# Altium schematic sheet 0067_SMART_C_COVER.SchDoc
size 848 x 558 mm
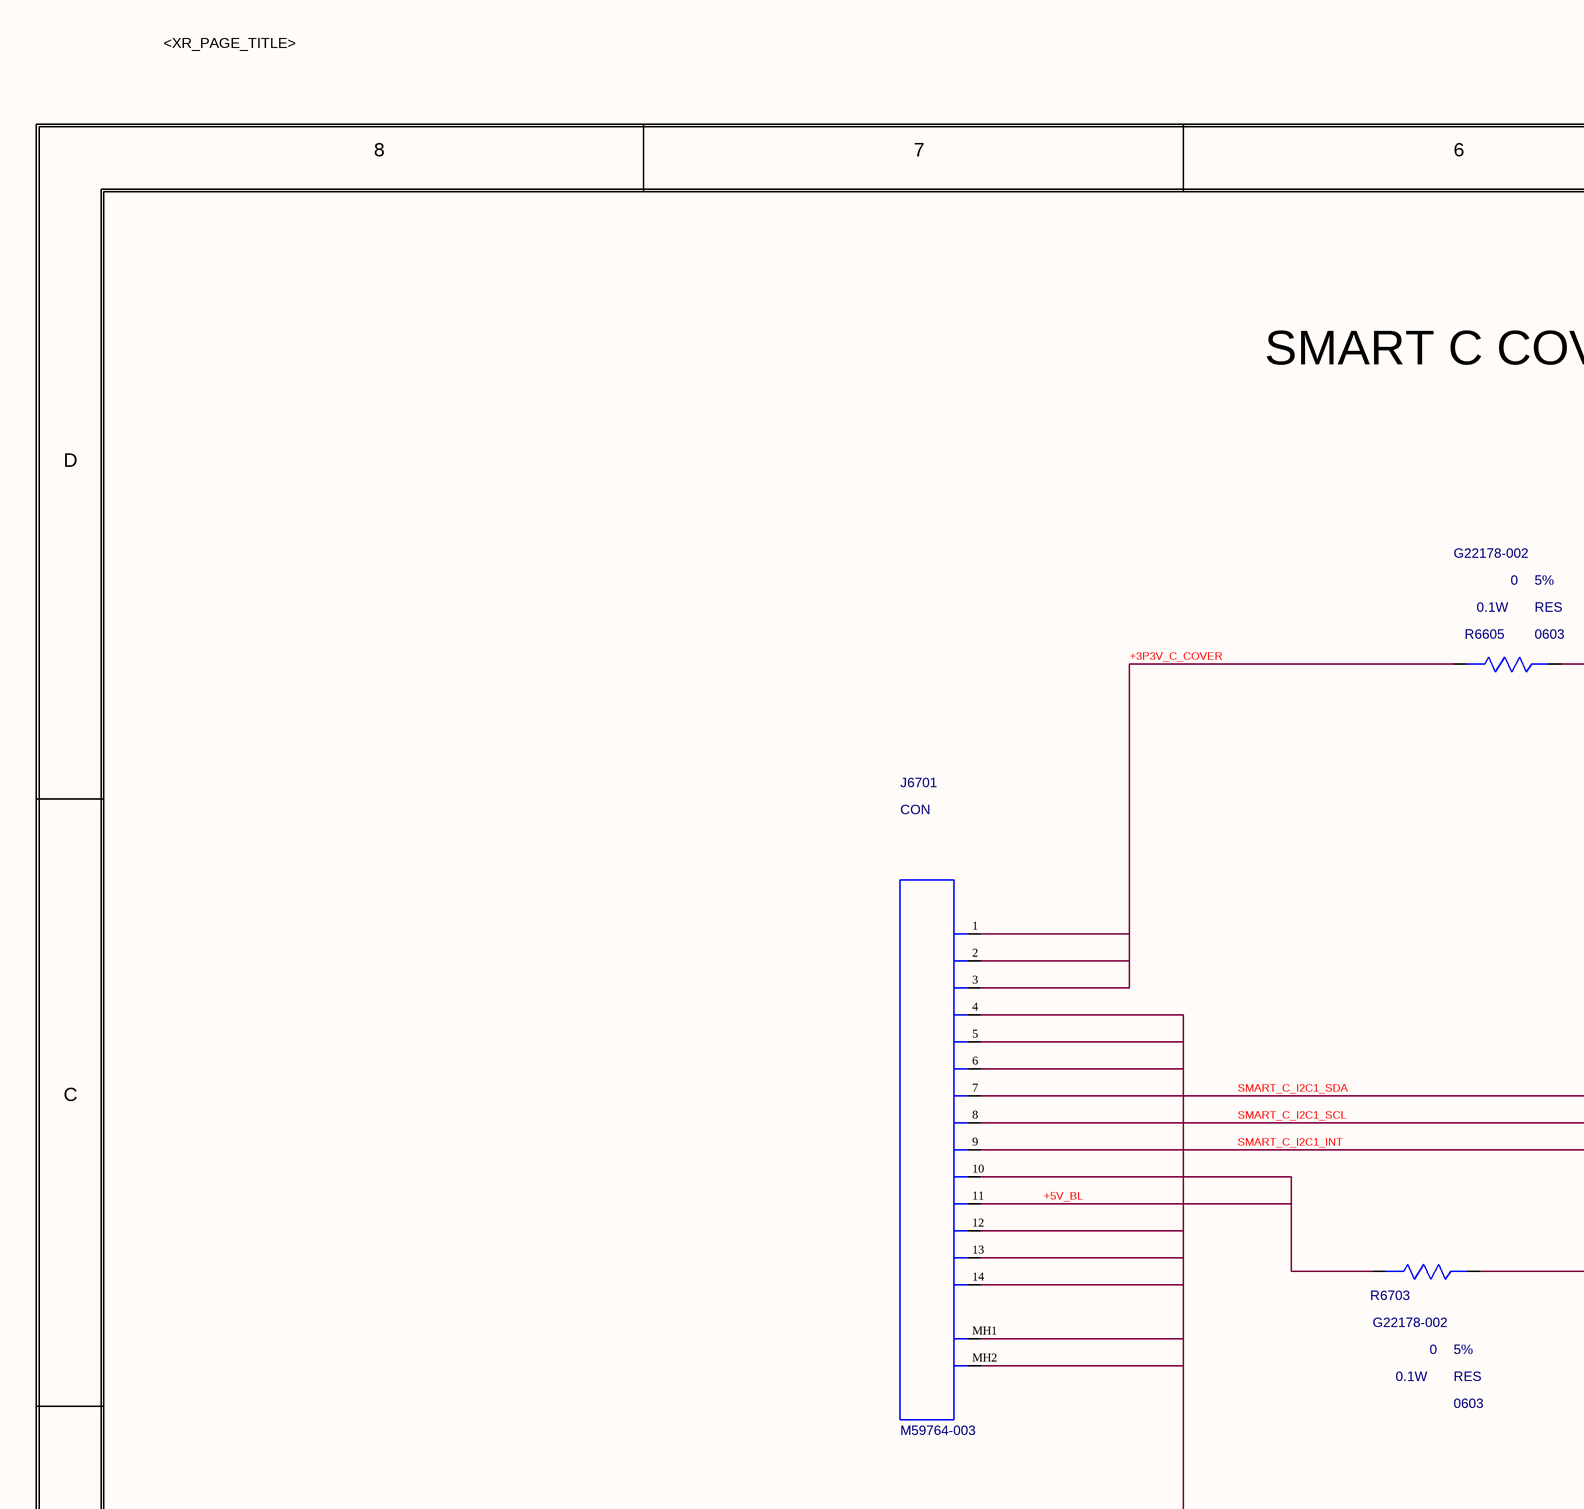
[diagram p0: 0067_SMART_C_COVER.SchDoc, top left]
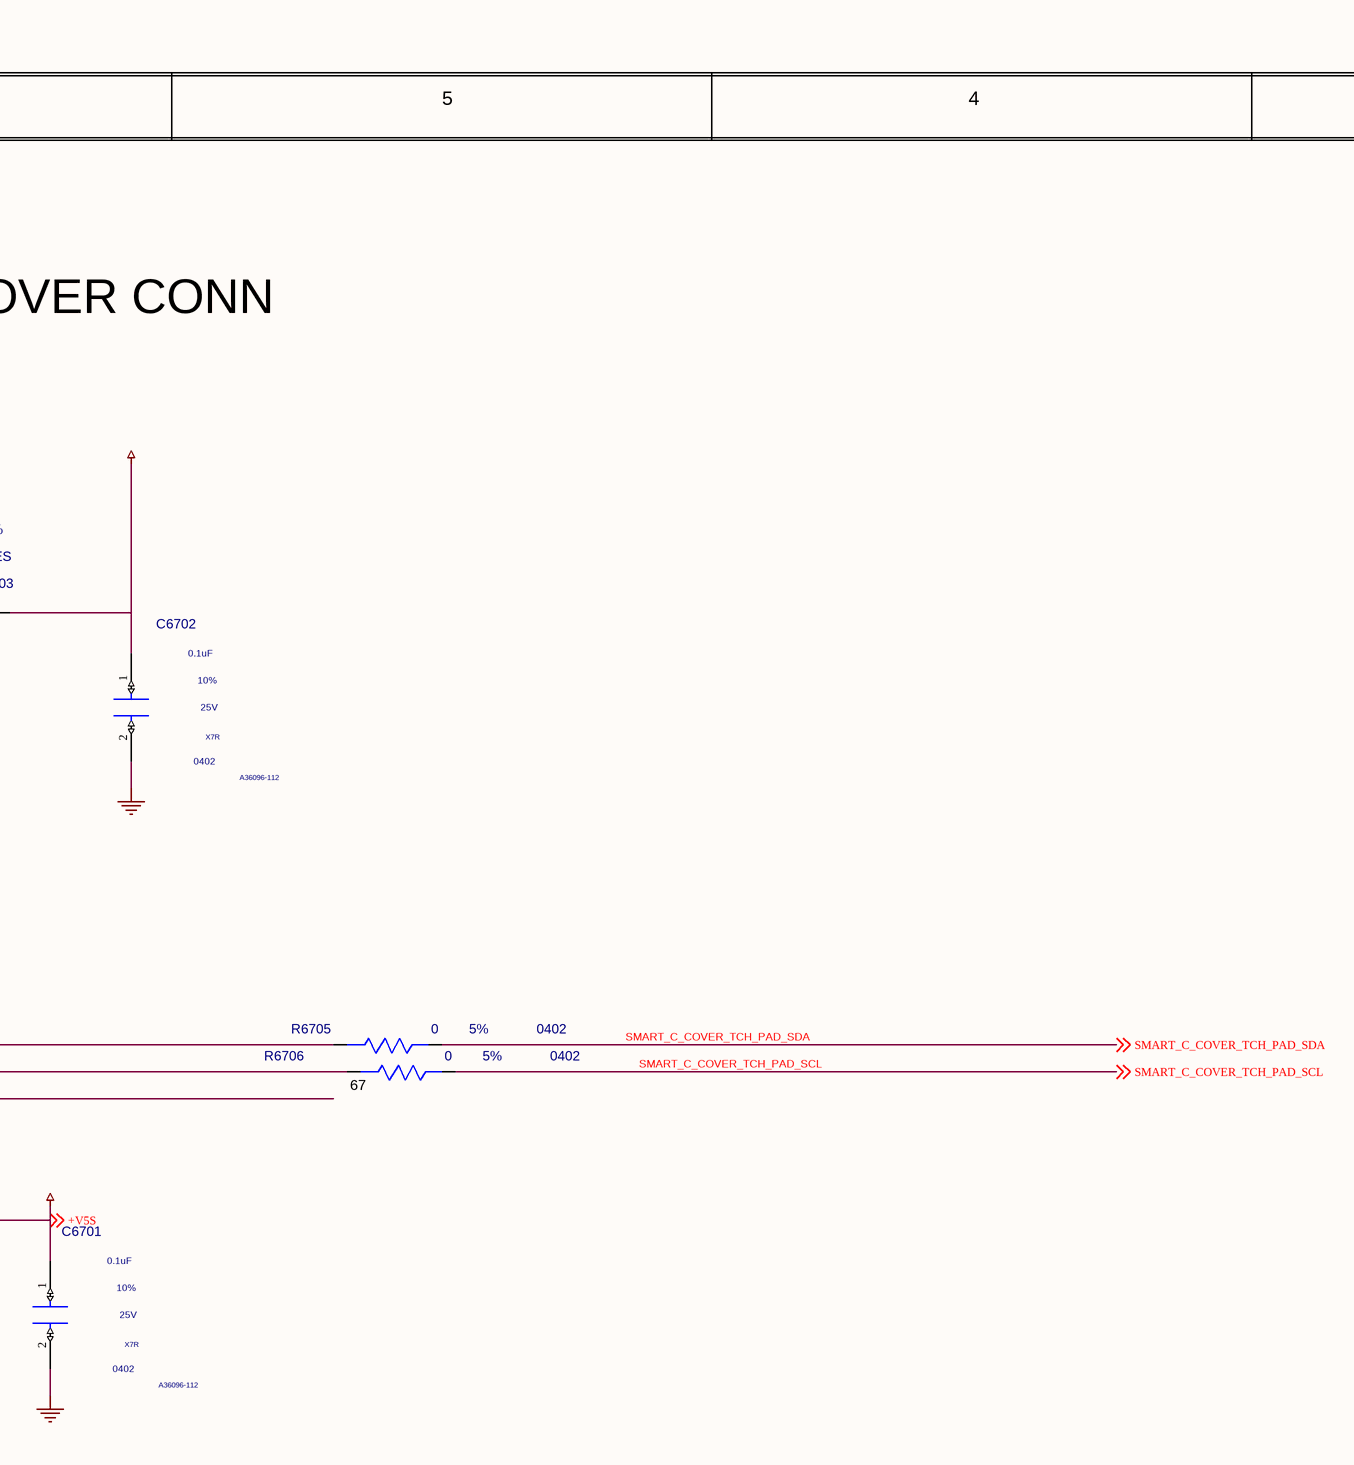
[diagram p1: 0067_SMART_C_COVER.SchDoc, top middle]
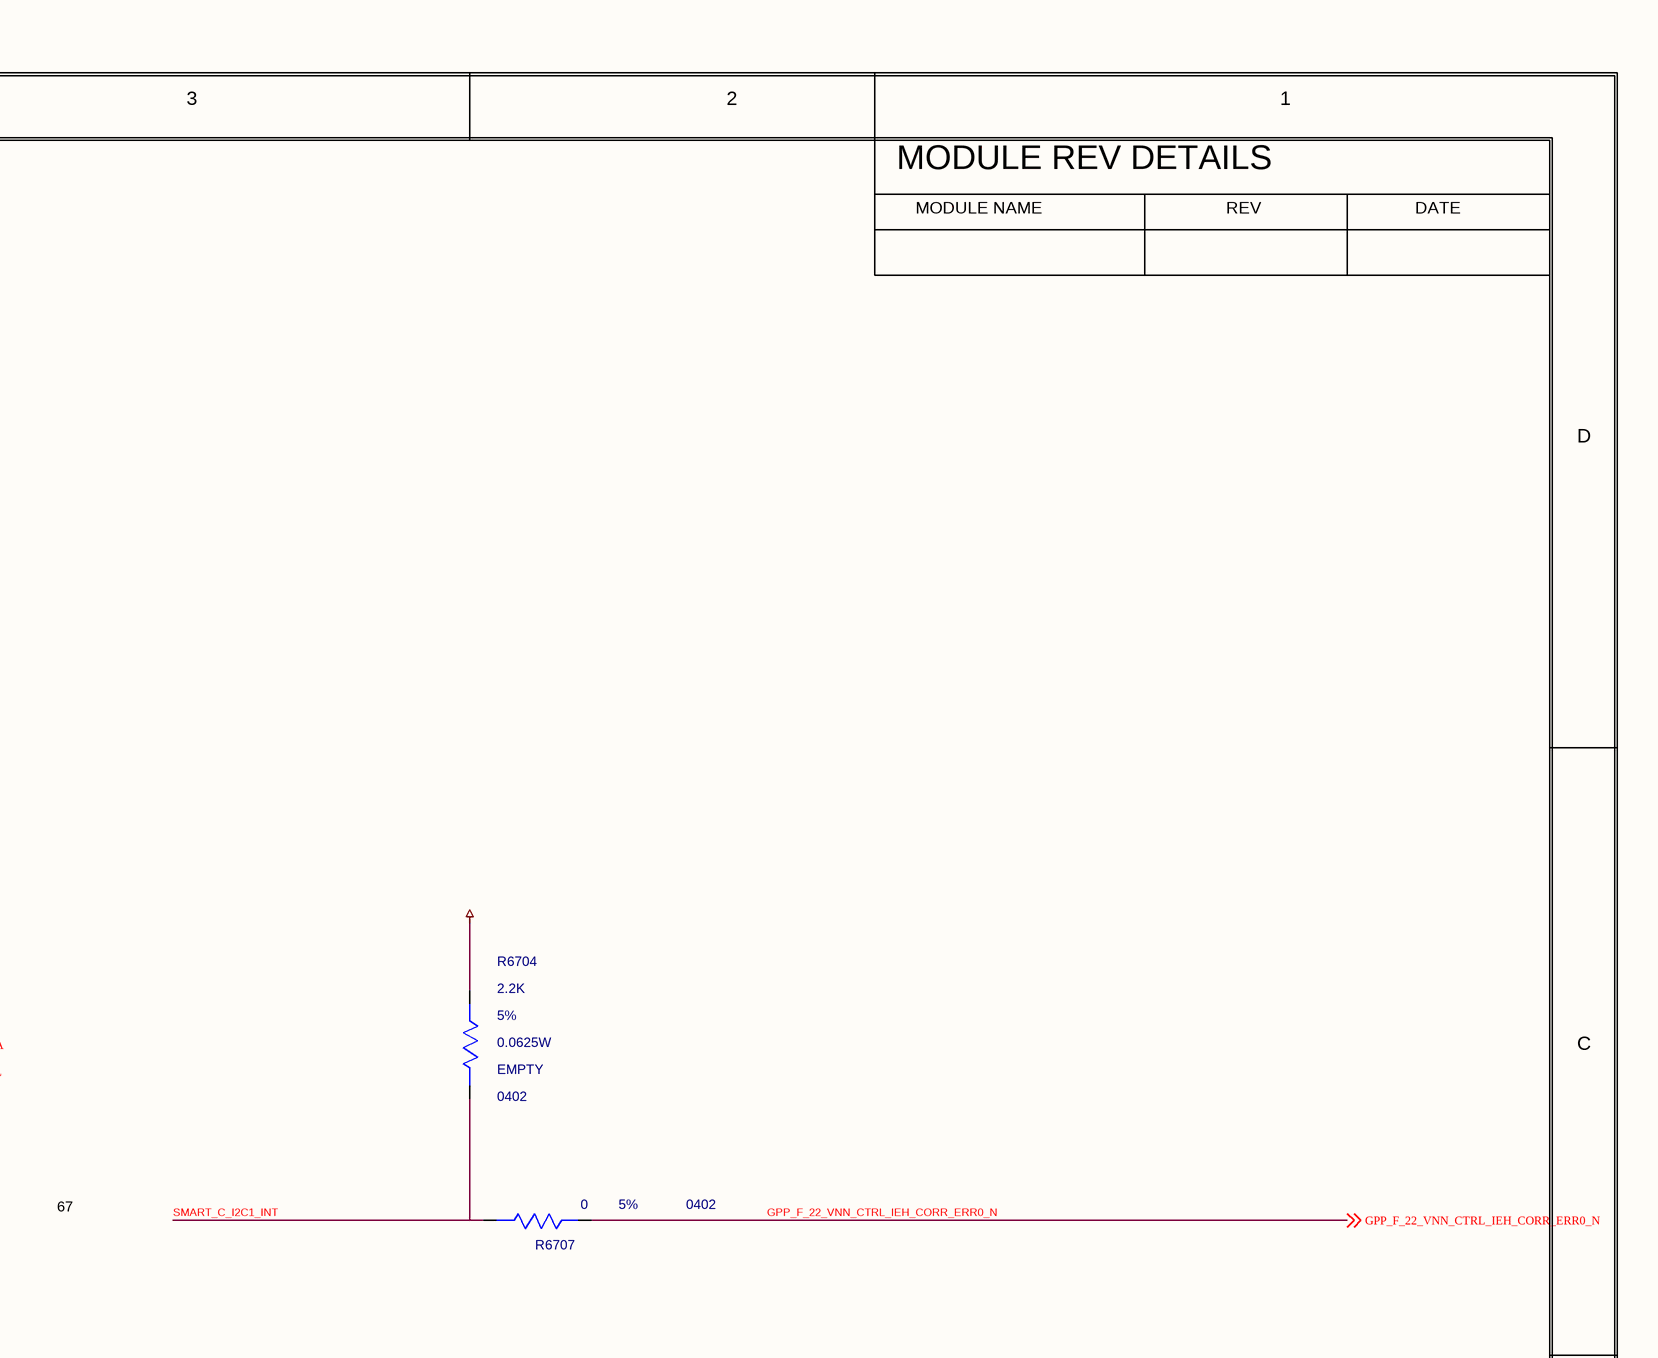
[diagram p2: 0067_SMART_C_COVER.SchDoc, top right]
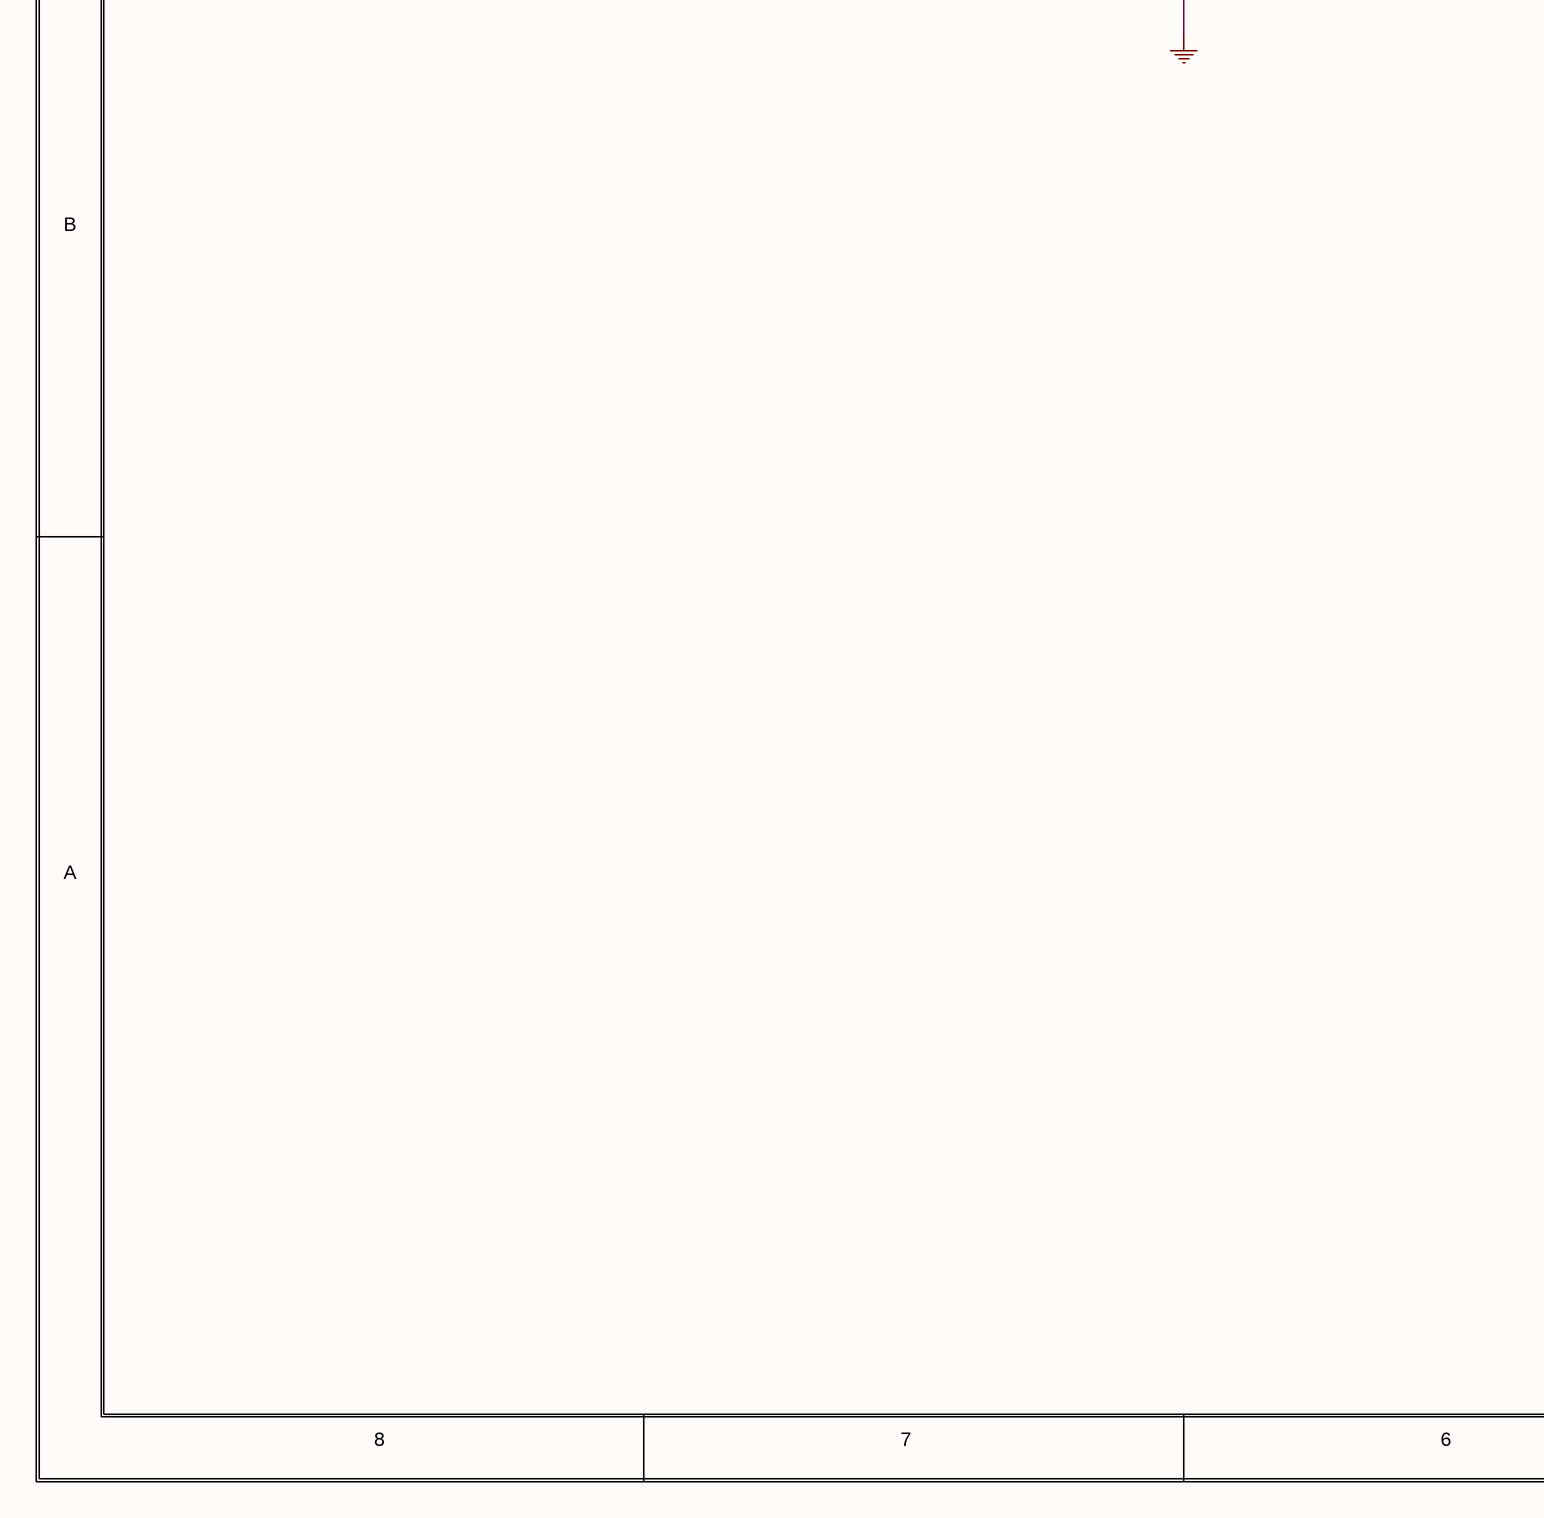
[diagram p3: 0067_SMART_C_COVER.SchDoc, bottom left]
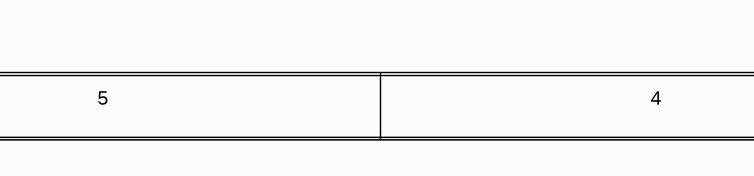
[diagram p4: 0067_SMART_C_COVER.SchDoc, bottom middle]
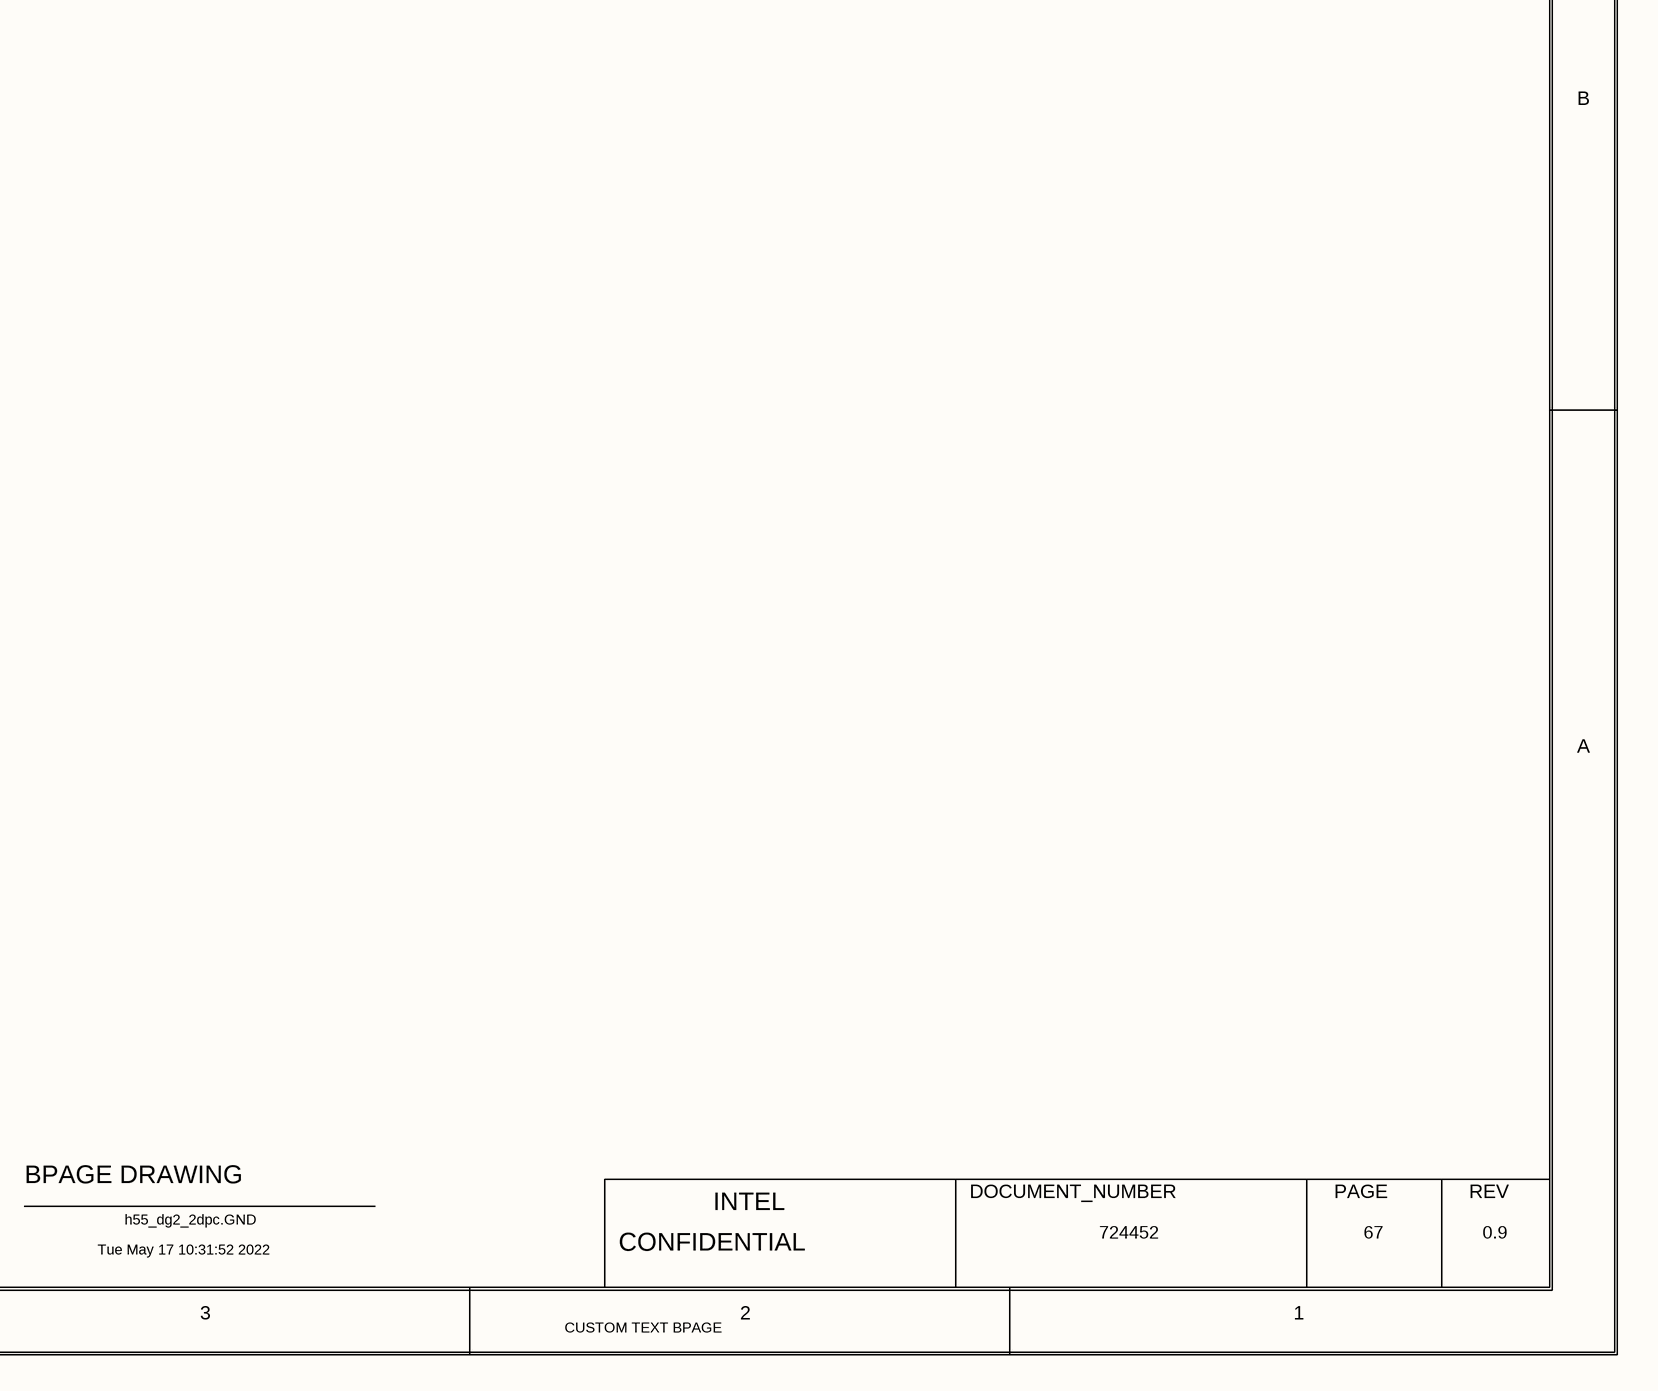
[diagram p5: 0067_SMART_C_COVER.SchDoc, bottom right]

## Parts
C6701  0.1uF  MATERIAL: X7R  PACK_TYPE: 0402  PART_NUMBER: A36096-112  TOLERANCE: 10%  VOLTAGE: 25V  [SMC0402IA]
C6702  0.1uF  MATERIAL: X7R  PACK_TYPE: 0402  PART_NUMBER: A36096-112  TOLERANCE: 10%  VOLTAGE: 25V  [SMC0402IA]
J6701  MATERIAL: CON  PART_NUMBER: M59764-003  [CTK0_B2B_SJR_1X14_2EM_500_MA_VR]  (hidden comment: C_B2B_1X14_2EM)
R6605  0  MATERIAL: RES  PACK_TYPE: 0603  PART_NUMBER: G22178-002  TOLERANCE: 5%  WATTAGE: 0.1W  [CTK0_SM0603_1700X950_MA]
R6703  0  MATERIAL: RES  PACK_TYPE: 0603  PART_NUMBER: G22178-002  TOLERANCE: 5%  WATTAGE: 0.1W  [CTK0_SM0603_1700X950_MA]
R6704  2.2K  MATERIAL: EMPTY  PACK_TYPE: 0402  TOLERANCE: 5%  WATTAGE: 0.0625W  [CTK2_SM0402_1050X550_MA]
R6705  0  PACK_TYPE: 0402  TOLERANCE: 5%  [CTK2_SM0402_1100X550_MA]
R6706  0  PACK_TYPE: 0402  TOLERANCE: 5%  [CTK2_SM0402_1100X550_MA]
R6707  0  PACK_TYPE: 0402  TOLERANCE: 5%  [CTK2_SM0402_1100X550_MA]

## Nets
+V3P3A_CLICK_PAD: R6704.1(A)
+V3P3A_KBC: C6702.1(A) R6605.2(B)
+V5S: C6701.1(A) R6703.2(B) ; off-sheet +V5S
GND: C6701.2(B) C6702.2(B) J6701.4(IO4) J6701.5(IO5) J6701.6(IO6) J6701.12(IO12) J6701.13(IO13) J6701.14(IO14) J6701.MH1 J6701.MH2
+3P3V_C_COVER: J6701.1(IO1) J6701.2(IO2) J6701.3(IO3) R6605.1(A)
+5V_BL: J6701.10(IO10) J6701.11(IO11) R6703.1(A)
GPP_F_22_VNN_CTRL_IEH_CORR_ERR0_N: R6707.2(B) ; off-sheet GPP_F_22_VNN_CTRL_IEH_CORR_ERR0_N
SMART_C_COVER_TCH_PAD_SCL: R6706.2(B) ; off-sheet SMART_C_COVER_TCH_PAD_SCL
SMART_C_COVER_TCH_PAD_SDA: R6705.2(B) ; off-sheet SMART_C_COVER_TCH_PAD_SDA
SMART_C_I2C1_INT: J6701.9(IO9) R6704.2(B) R6707.1(A)
SMART_C_I2C1_SCL: J6701.8(IO8) R6706.1(A)
SMART_C_I2C1_SDA: J6701.7(IO7) R6705.1(A)

## Notes on the sheet
- <XR_PAGE_TITLE>
- 8
- 7
- 6
- 5
- 4
- 3
- 2
- 1
- MODULE REV DETAILS
- MODULE NAME
- REV
- DATE
- SMART C COVER CONN
- D
- C
- (near R6706) 67
- 67
- B
- A
- BPAGE DRAWING
- INTEL
- DOCUMENT_NUMBER
- PAGE
- Tue May 17 10:31:52 2022
- h55_dg2_2dpc.GND
- CONFIDENTIAL
- 724452
- 0.9
- CUSTOM TEXT BPAGE

## Library data of the parts
C6701 = CAP: CDS_PHYS_PART_NAME: CAP_0402-A36096-112,X7R,0.1UF,25V,10%,LPDB,GENERIC; OriginalSymbolOrigin: (-50,25); XY: (-5225,2825); VER: 1; ROT: 2; PHYS_PAGE: 67; LOCATION: C6701; IP: GENERIC; FP_TECH: LPDB; DRAWING: @RVP1_ADL_SB_ADP_S_DDR5_SODIMM_2DPC_LIB.H55_DG2_2DPC(SCH_1):PAGE67; CDS_LIB: discrete; PCB Footprint: SMC0402IA; CHIPS_PART_NAME: CAP; CDS_PART_NAME: CAP_0402-A36096-112,X7R,0.1UF,25V,10%,LPDB,GENERIC; CDS_LOCATION: C6701; ASI_MODEL: A36096-112
C6702 = CAP: CDS_PHYS_PART_NAME: CAP_0402-A36096-112,X7R,0.1UF,25V,10%,LPDB,GENERIC; OriginalSymbolOrigin: (-50,25); XY: (-5075,3950); VER: 1; ROT: 2; PHYS_PAGE: 67; LOCATION: C6702; IP: GENERIC; FP_TECH: LPDB; DRAWING: @RVP1_ADL_SB_ADP_S_DDR5_SODIMM_2DPC_LIB.H55_DG2_2DPC(SCH_1):PAGE67; CDS_LIB: discrete; PCB Footprint: SMC0402IA; CHIPS_PART_NAME: CAP; CDS_PART_NAME: CAP_0402-A36096-112,X7R,0.1UF,25V,10%,LPDB,GENERIC; CDS_LOCATION: C6702; ASI_MODEL: A36096-112
J6701 = C_B2B_1X14_2EM: CDS_PHYS_PART_NAME: C_B2B_1X14_2EM_SM-M59764-003,CON,B2B_1X14_2EM,TK0,GENERIC; CDS_LMAN_SYM_OUTLINE: -50,500,50,-500; FP_TECH: TK0; IP: GENERIC; PACK_TYPE: SM; ROOM: NONE; OriginalSymbolOrigin: (-50,500); XY: (-6475,3225); VER: 1; ROT: 0; PHYS_PAGE: 67; LOCATION: J6701; DRAWING: @RVP1_ADL_SB_ADP_S_DDR5_SODIMM_2DPC_LIB.H55_DG2_2DPC(SCH_1):PAGE67; CDS_LIB: local; VARIANT: ?; PCB Footprint: CTK0_B2B_SJR_1X14_2EM_500_MA_VR; CHIPS_PART_NAME: C_B2B_1X14_2EM; CDS_PART_NAME: C_B2B_1X14_2EM_SM-M59764-003,CON,B2B_1X14_2EM,TK0,GENERIC; CDS_LOCATION: J6701
R6605 = C_RES#1: CHIPS_PART_NAME: C_RES; CDS_PHYS_PART_NAME: C_RES_0603-G22178-002,RES,0,5%,0.1W,TK0,GENERIC; CDS_LMAN_SYM_OUTLINE: -50,50,50,-50; FP_TECH: TK0; IP: GENERIC; ROOM: NONE; OriginalSymbolOrigin: (-75,25); XY: (-5400,4125); VER: 1; PHYS_PAGE: 67; LOCATION: R6605; DRAWING: @RVP1_ADL_SB_ADP_S_DDR5_SODIMM_2DPC_LIB.H55_DG2_2DPC(SCH_1):PAGE67; CDS_LIB: c_discrete; VARIANT: ?; PCB Footprint: CTK0_SM0603_1700X950_MA; ROT: 0; CDS_PART_NAME: C_RES_0603-G22178-002,RES,0,5%,0.1W,TK0,GENERIC; CDS_LOCATION: R6605
R6703 = C_RES#1: CHIPS_PART_NAME: C_RES; CDS_PHYS_PART_NAME: C_RES_0603-G22178-002,RES,0,5%,0.1W,TK0,GENERIC; CDS_LMAN_SYM_OUTLINE: -50,50,50,-50; FP_TECH: TK0; IP: GENERIC; ROOM: NONE; OriginalSymbolOrigin: (-75,25); XY: (-5550,3000); VER: 1; PHYS_PAGE: 67; LOCATION: R6703; DRAWING: @RVP1_ADL_SB_ADP_S_DDR5_SODIMM_2DPC_LIB.H55_DG2_2DPC(SCH_1):PAGE67; CDS_LIB: c_discrete; VARIANT: ?; PCB Footprint: CTK0_SM0603_1700X950_MA; ROT: 0; CDS_PART_NAME: C_RES_0603-G22178-002,RES,0,5%,0.1W,TK0,GENERIC; CDS_LOCATION: R6703
R6704 = C_RES: PART_NUMBER: G21497-045; CDS_PHYS_PART_NAME: C_RES_0402-G21497-045,EMPTY,2.2K,5%,0.0625W,TK2,GENERIC; CDS_LMAN_SYM_OUTLINE: -50,50,50,-50; FP_TECH: TK2; IP: GENERIC; ROOM: NONE; OriginalSymbolOrigin: (-25,75); XY: (-2000,3325); VER: 2; ROT: 0; PHYS_PAGE: 67; LOCATION: R6704; DRAWING: @RVP1_ADL_SB_ADP_S_DDR5_SODIMM_2DPC_LIB.H55_DG2_2DPC(SCH_1):PAGE67; CDS_LIB: c_discrete; VARIANT: ?; PCB Footprint: CTK2_SM0402_1050X550_MA; CHIPS_PART_NAME: C_RES; CDS_PART_NAME: C_RES_0402-G21497-045,EMPTY,2.2K,5%,0.0625W,TK2,GENERIC; CDS_LOCATION: R6704
R6705 = C_RES#1: PART_NUMBER: C75811-002; CHIPS_PART_NAME: C_RES; CDS_PHYS_PART_NAME: C_RES_0402-C75811-002,RES,0,5%,0.0625W,TK2,GENERIC; CDS_LMAN_SYM_OUTLINE: -50,50,50,-50; FP_TECH: TK2; IP: GENERIC; ROOM: NONE; WATTAGE: 0.0625W; OriginalSymbolOrigin: (-75,25); XY: (-4600,3325); VER: 1; PHYS_PAGE: 67; LOCATION: R6705; DRAWING: @RVP1_ADL_SB_ADP_S_DDR5_SODIMM_2DPC_LIB.H55_DG2_2DPC(SCH_1):PAGE67; CDS_LIB: c_discrete; MATERIAL: RES; VARIANT: ?; PCB Footprint: CTK2_SM0402_1100X550_MA; ROT: 0; CDS_PART_NAME: C_RES_0402-C75811-002,RES,0,5%,0.0625W,TK2,GENERIC; CDS_LOCATION: R6705
R6706 = C_RES#1: PART_NUMBER: C75811-002; CHIPS_PART_NAME: C_RES; CDS_PHYS_PART_NAME: C_RES_0402-C75811-002,RES,0,5%,0.0625W,TK2,GENERIC; CDS_LMAN_SYM_OUTLINE: -50,50,50,-50; FP_TECH: TK2; IP: GENERIC; ROOM: NONE; WATTAGE: 0.0625W; OriginalSymbolOrigin: (-75,25); XY: (-4575,3275); VER: 1; PHYS_PAGE: 67; LOCATION: R6706; DRAWING: @RVP1_ADL_SB_ADP_S_DDR5_SODIMM_2DPC_LIB.H55_DG2_2DPC(SCH_1):PAGE67; CDS_LIB: c_discrete; MATERIAL: RES; VARIANT: ?; PCB Footprint: CTK2_SM0402_1100X550_MA; ROT: 0; CDS_PART_NAME: C_RES_0402-C75811-002,RES,0,5%,0.0625W,TK2,GENERIC; CDS_LOCATION: R6706
R6707 = C_RES#1: PART_NUMBER: C75811-002; CHIPS_PART_NAME: C_RES; CDS_PHYS_PART_NAME: C_RES_0402-C75811-002,RES,0,5%,0.0625W,TK2,GENERIC; CDS_LMAN_SYM_OUTLINE: -50,50,50,-50; FP_TECH: TK2; IP: GENERIC; ROOM: NONE; WATTAGE: 0.0625W; OriginalSymbolOrigin: (-75,25); XY: (-1875,3000); VER: 1; PHYS_PAGE: 67; LOCATION: R6707; DRAWING: @RVP1_ADL_SB_ADP_S_DDR5_SODIMM_2DPC_LIB.H55_DG2_2DPC(SCH_1):PAGE67; CDS_LIB: c_discrete; MATERIAL: RES; VARIANT: ?; PCB Footprint: CTK2_SM0402_1100X550_MA; ROT: 0; CDS_PART_NAME: C_RES_0402-C75811-002,RES,0,5%,0.0625W,TK2,GENERIC; CDS_LOCATION: R6707